# Altium schematic sheet Sheet.SchDoc
size A4; SheetNumber: 1; SheetTotal: 1
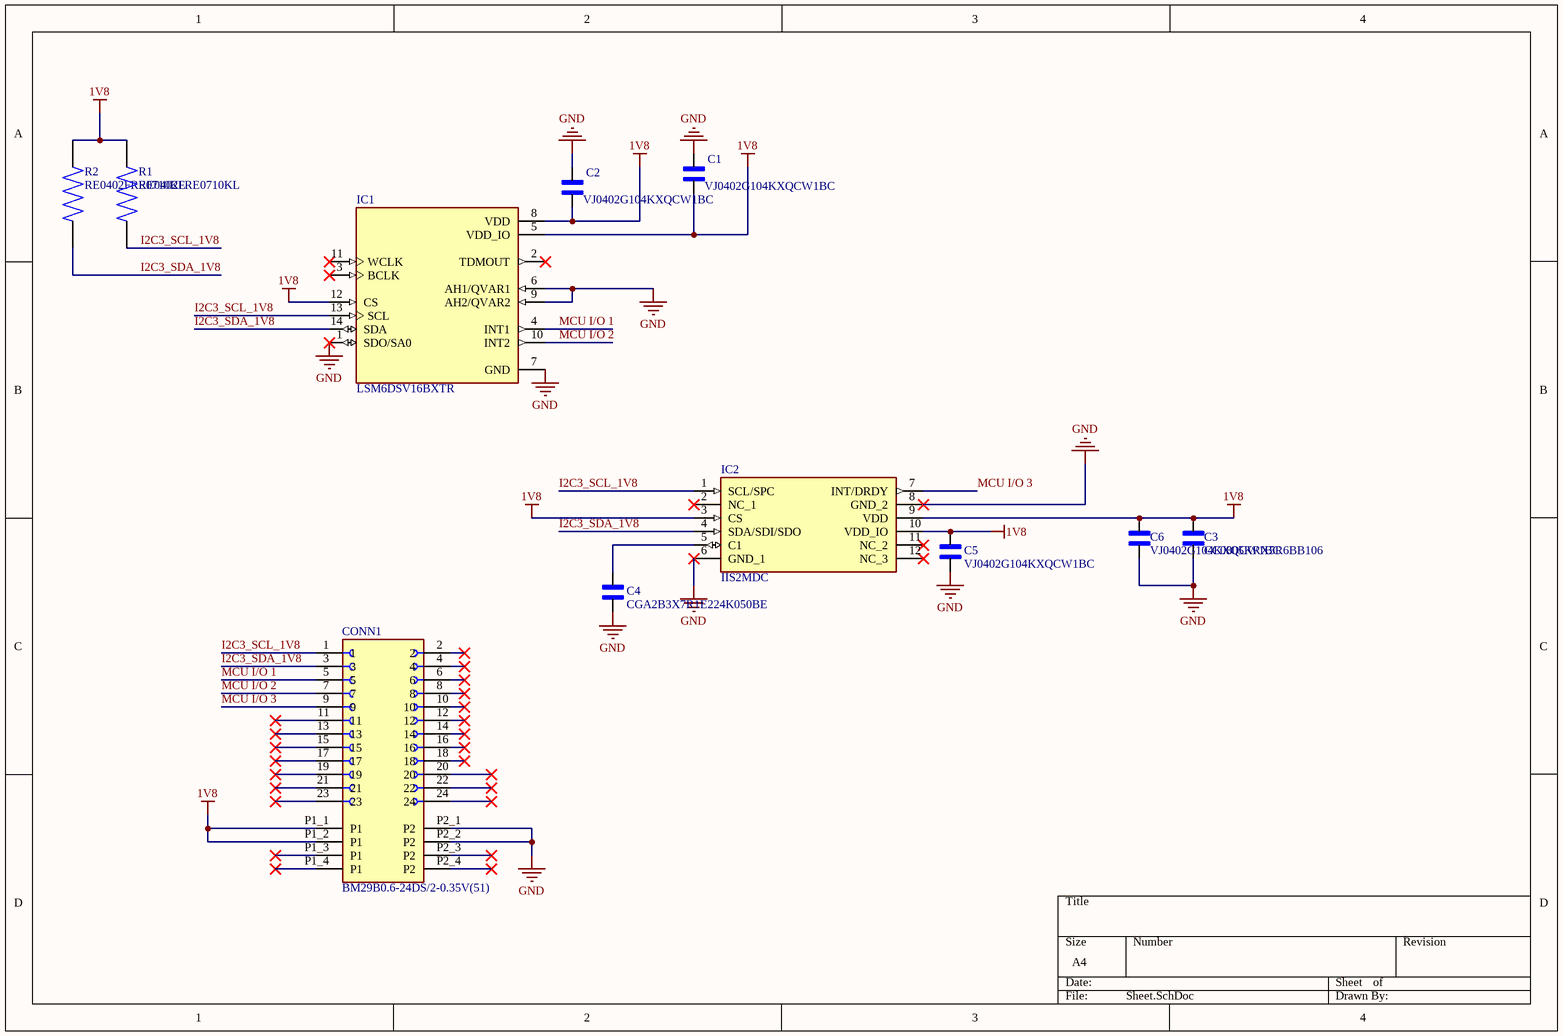
[diagram p0: Sheet.SchDoc]

## Parts
C1  VJ0402G104KXQCW1BC  [C100nF - VJ0402G104KXQCW1BC]
C2  VJ0402G104KXQCW1BC  [C100nF - VJ0402G104KXQCW1BC]
C3  CC0805KRX5R6BB106  [C10uf - CC0805KRX5R6BB106]
C4  CGA2B3X7R1E224K050BE  [CAPC1005X60N]
C5  VJ0402G104KXQCW1BC  [C100nF - VJ0402G104KXQCW1BC]
C6  VJ0402G104KXQCW1BC  [C100nF - VJ0402G104KXQCW1BC]
CONN1  BM29B0.6-24DS/2-0.35V(51)  [HRS_BM29B0.6-24DS/2-0.35V(51)]
IC1  LSM6DSV16BXTR  [PQFN50P250X300X74-14N]
IC2  IIS2MDC  [Magnetometer]
R1  RE0402FRE0710KL  [RESC1005X37N]
R2  RE0402FRE0710KL  [RESC1005X37N]

## Nets
1V8: C1.1 C2.1 C3.1 C5.2 C6.1 CONN1.P1_1(P1) CONN1.P1_2(P1) IC1.5(VDD_IO) IC1.8(VDD) IC1.12(CS) IC2.3(CS) IC2.9(VDD) IC2.10(VDD_IO) R1.1 R2.1
GND: C1.2 C2.2 C3.2 C4.1 C5.1 C6.2 CONN1.P2_1(P2) CONN1.P2_2(P2) IC1.1(SDO/SA0) IC1.6(AH1/QVAR1) IC1.7(GND) IC1.9(AH2/QVAR2) IC2.6(GND_1) IC2.8(GND_2)
I2C3_SCL_1V8: CONN1.1 IC1.13(SCL) IC2.1(SCL/SPC) R1.2
I2C3_SDA_1V8: CONN1.3 IC1.14(SDA) IC2.4(SDA/SDI/SDO) R2.2
MCU I/O 1: CONN1.5 IC1.4(INT1)
MCU I/O 2: CONN1.7 IC1.10(INT2)
MCU I/O 3: CONN1.9 IC2.7(INT/DRDY)
NetC4_2: C4.2 IC2.5(C1)

Not connected (* = marked no-connect by the designer): CONN1 2* 4* 6* 8* 10* 11* 12* 13* 14* 15* 16* 17* 18* 19* 20* 21* 22* 23* 24* P1_3(P1)* P1_4(P1)* P2_3(P2)* P2_4(P2)*; IC1 2(TDMOUT)* 3(BCLK)* 11(WCLK)*; IC2 2(NC_1)* 11(NC_2)* 12(NC_3)*

## Library data of the parts
C3 = C 10uF: Supplier 1: RS; Supplier Part Number 1: 1988126P
C4 = CGA2B3X7R1E224K050BE: Cap Ceramic 0.22uF 25V X7R 10% Pad SMD 0402 Soft Termination 125C Automotive T/R; MF: TDK; SnapEDA_Link: https://www.snapeda.com/parts/CGA2B3X7R1E224K050BE/TDK/view-part/?ref=snap; Package: 1005 TDK; Value: *; MP: CGA2B3X7R1E224K050BE; Check_prices: https://www.snapeda.com/parts/CGA2B3X7R1E224K050BE/TDK/view-part/?ref=eda; Supplier 1: Farnell; Supplier Part Number 1: CGA2B3X7R1E224K050BE
C5 C6 = C 100nf: Supplier 1: Future Electronics; Supplier Part Number 1: 6981047
CONN1 = BM29B0.6-24DS/2-0.35V(51): 26 (24 + 2 Power) Position Connector Receptacle, Center Strip Contacts Surface Mount Gold; MF: Hirose Connector; SnapEDA_Link: https://www.snapeda.com/parts/BM29B0.6-24DS/2-0.35V(51)/Hirose/view-part/?ref=snap; Package: None; Value: *; MP: BM29B0.6-24DS/2-0.35V(51); Check_prices: https://www.snapeda.com/parts/BM29B0.6-24DS/2-0.35V(51)/Hirose/view-part/?ref=eda
IC1 = LSM6DSV16BXTR: Accelerometer, Gyroscope, Temperature, 6 Axis Sensor IÂ²C, I3Câ„ , SPI Output; MF: STMicroelectronics; SnapEDA_Link: https://www.snapeda.com/parts/LSM6DSV16BXTR/STMicroelectronics/view-part/?ref=snap; Package: LGA-14 STMicroelectronics; Value: *; MP: LSM6DSV16BXTR; Check_prices: https://www.snapeda.com/parts/LSM6DSV16BXTR/STMicroelectronics/view-part/?ref=eda; Supplier 1: RS; Supplier Part Number 1: 2615021
R1 R2 = RE0402FRE0710KL: 10 kOhms Â±1% 0.063W, 1/16W Chip Resistor 0402 (1005 Metric) Moisture Resistant Thick Film; MF: Yageo; SnapEDA_Link: https://www.snapeda.com/parts/RE0402FRE0710KL/Yageo/view-part/?ref=snap; Package: 1005 Yageo; Value: *; MP: RE0402FRE0710KL; Check_prices: https://www.snapeda.com/parts/RE0402FRE0710KL/Yageo/view-part/?ref=eda
C1 C2 = VJ0402G104KXQCW1BC: Supplier 1: Future Electronics; Supplier Part Number 1: VJ0402G104KXQCW1BC